# Altium project motorAddOn_mk1.PrjPcb
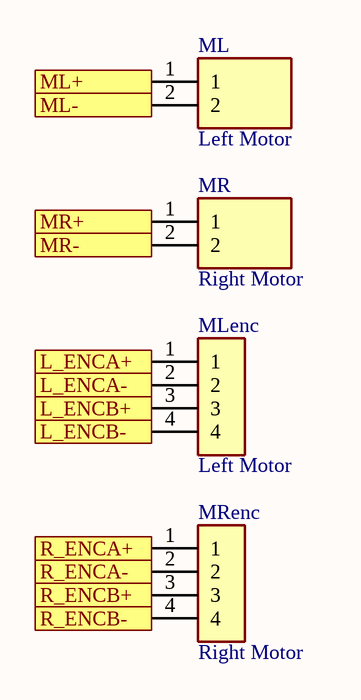
[diagram p0: Sheet3.SchDoc]
1 sheet, 4 parts. Net scope: flat (ports and power ports of the same name join across sheets).

## Sheet Sheet3.SchDoc
size A

### Parts
ML  Left Motor  [TE_796739-2]
MLenc  Left Motor  [JST_B4B-XH-A(LF)(SN)]
MR  Right Motor  [TE_796739-2]
MRenc  Right Motor  [JST_B4B-XH-A(LF)(SN)]

### Ports
L_ENCA+ (out), L_ENCA- (out), L_ENCB+ (out), L_ENCB- (out), ML+ (out), ML- (out), MR+ (out), MR- (out), R_ENCA+ (out), R_ENCA- (out), R_ENCB+ (out), R_ENCB- (out)

### Nets
NetML_1: ML.1 ; port ML+
NetML_2: ML.2 ; port ML-
NetMLenc_1: MLenc.1 ; port L_ENCA+
NetMLenc_2: MLenc.2 ; port L_ENCA-
NetMLenc_3: MLenc.3 ; port L_ENCB+
NetMLenc_4: MLenc.4 ; port L_ENCB-
NetMR_1: MR.1 ; port MR+
NetMR_2: MR.2 ; port MR-
NetMRenc_1: MRenc.1 ; port R_ENCA+
NetMRenc_2: MRenc.2 ; port R_ENCA-
NetMRenc_3: MRenc.3 ; port R_ENCB+
NetMRenc_4: MRenc.4 ; port R_ENCB-

### Library data of the parts
ML MR = 796739-2: Conn Terminal Block F 2 POS 9.53mm Solder RA Thru-Hole 32A/Contact; MF: TE Connectivity; Number_of_Positions: 2; Centerline_Pitch: 9.53 mm[.375 in]; Package: None; Value: *; Price: None; EU_RoHS_Compliance: Compliant with Exemptions; MP: 796739-2; TE_purchase_URL: https://www.te.com/usa-en/product-796739-2.html?te_bu=Cor&te_type=disp&te_campaign=seda_glo_cor-seda-global-disp-prtnr-fy19-seda-model-bom-cta_sma-317_1&elqCampaignId=32493; Availability: Unavailable; SnapEDA_Link: https://www.snapeda.com/parts/796739-2/TE%20Connectivity%20AMP%20Connectors/view-part/279084/?ref=snap
MLenc MRenc = B4B-XH-A(LF)(SN): XH Series 4 Position 2.5 mm Pitch Through Hole Crimp Top Entry Shrouded Header; MF: {'manufacturer': u'JST Sales America Inc.'}; Package: None; Price: None; Availability: Unavailable; Value: *; MP: B4B-XH-A(LF)(SN)